# Altium project Capacitive_Sensor.PrjPcb
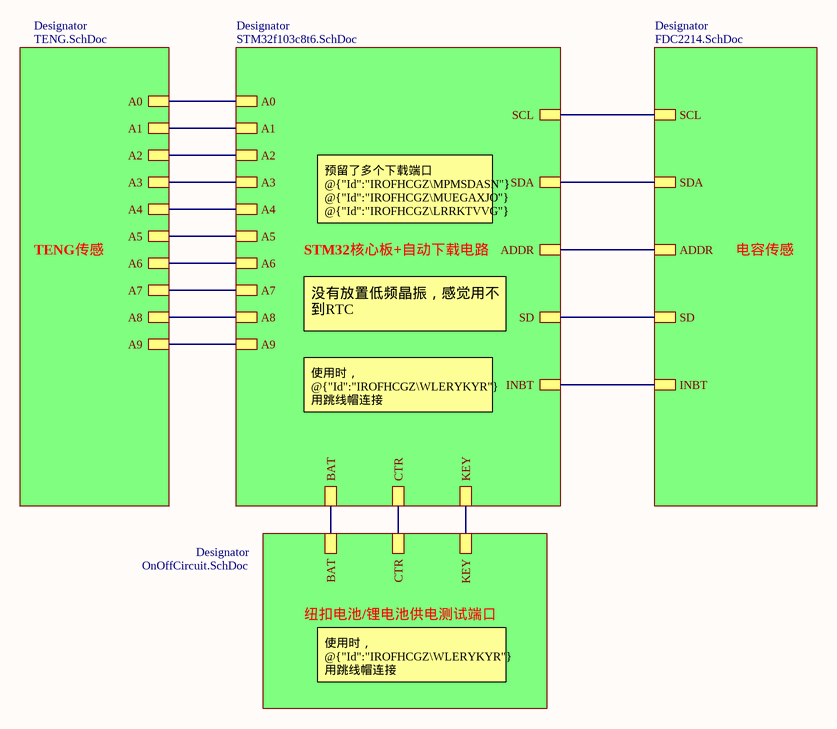
[diagram p0: Insight.SchDoc]
5 sheets, 156 parts. Net scope: hierarchical (ports join the sheet entries above them; power ports are global).
Board file: Cap_TENG.PcbDoc
Sheets:
  Insight.SchDoc
    Designator = STM32f103c8t6.SchDoc
    Designator = FDC2214.SchDoc
    Designator = TENG.SchDoc
    Designator = OnOffCircuit.SchDoc

## Sheet Insight.SchDoc
size A4; SheetNumber: 1; SheetTotal: 5

### Sub-sheets
Designator = STM32f103c8t6.SchDoc: A0, A1, A2, A3, A4, A5, A6, A7, A8, A9, SCL, SDA, ADDR, SD, INBT, BAT, CTR, KEY
Designator = FDC2214.SchDoc: SCL, SDA, SD, INBT, ADDR
Designator = TENG.SchDoc: A0, A1, A2, A3, A4, A5, A6, A7, A9, A8
Designator = OnOffCircuit.SchDoc: BAT, CTR, KEY

### Nets
A0: sheet Designator/A0, sheet Designator/A0
A1: sheet Designator/A1, sheet Designator/A1
A2: sheet Designator/A2, sheet Designator/A2
A3: sheet Designator/A3, sheet Designator/A3
A4: sheet Designator/A4, sheet Designator/A4
A5: sheet Designator/A5, sheet Designator/A5
A6: sheet Designator/A6, sheet Designator/A6
A7: sheet Designator/A7, sheet Designator/A7
A8: sheet Designator/A8, sheet Designator/A8
A9: sheet Designator/A9, sheet Designator/A9
B5: sheet Designator/SD, sheet Designator/SD
B6: sheet Designator/SCL, sheet Designator/SCL
B7: sheet Designator/SDA, sheet Designator/SDA
B8: sheet Designator/INBT, sheet Designator/INBT
B9: sheet Designator/ADDR, sheet Designator/ADDR
B12: sheet Designator/KEY, sheet Designator/KEY
B13: sheet Designator/CTR, sheet Designator/CTR
NetBAT1_1: sheet Designator/BAT, sheet Designator/BAT

### Notes on the sheet
- TENG传感
- STM32核心板+自动下载电路
- 预留了多个下载端口
  @{"Id":"IROFHCGZ\MPMSDASN"} @{"Id":"IROFHCGZ\MUEGAXJO"} @{"Id":"IROFHCGZ\LRRKTVVG"}
- 电容传感
- 没有放置低频晶振，感觉用不到RTC
- 使用时， @{"Id":"IROFHCGZ\WLERYKYR"}用跳线帽连接
  建议连接1，2引脚。
- 纽扣电池/锂电池供电测试端口
- 使用时， @{"Id":"IROFHCGZ\WLERYKYR"}用跳线帽连接
  建议连接2，3引脚。

## Sheet STM32f103c8t6.SchDoc
size A4; SheetNumber: 2; SheetTotal: 5
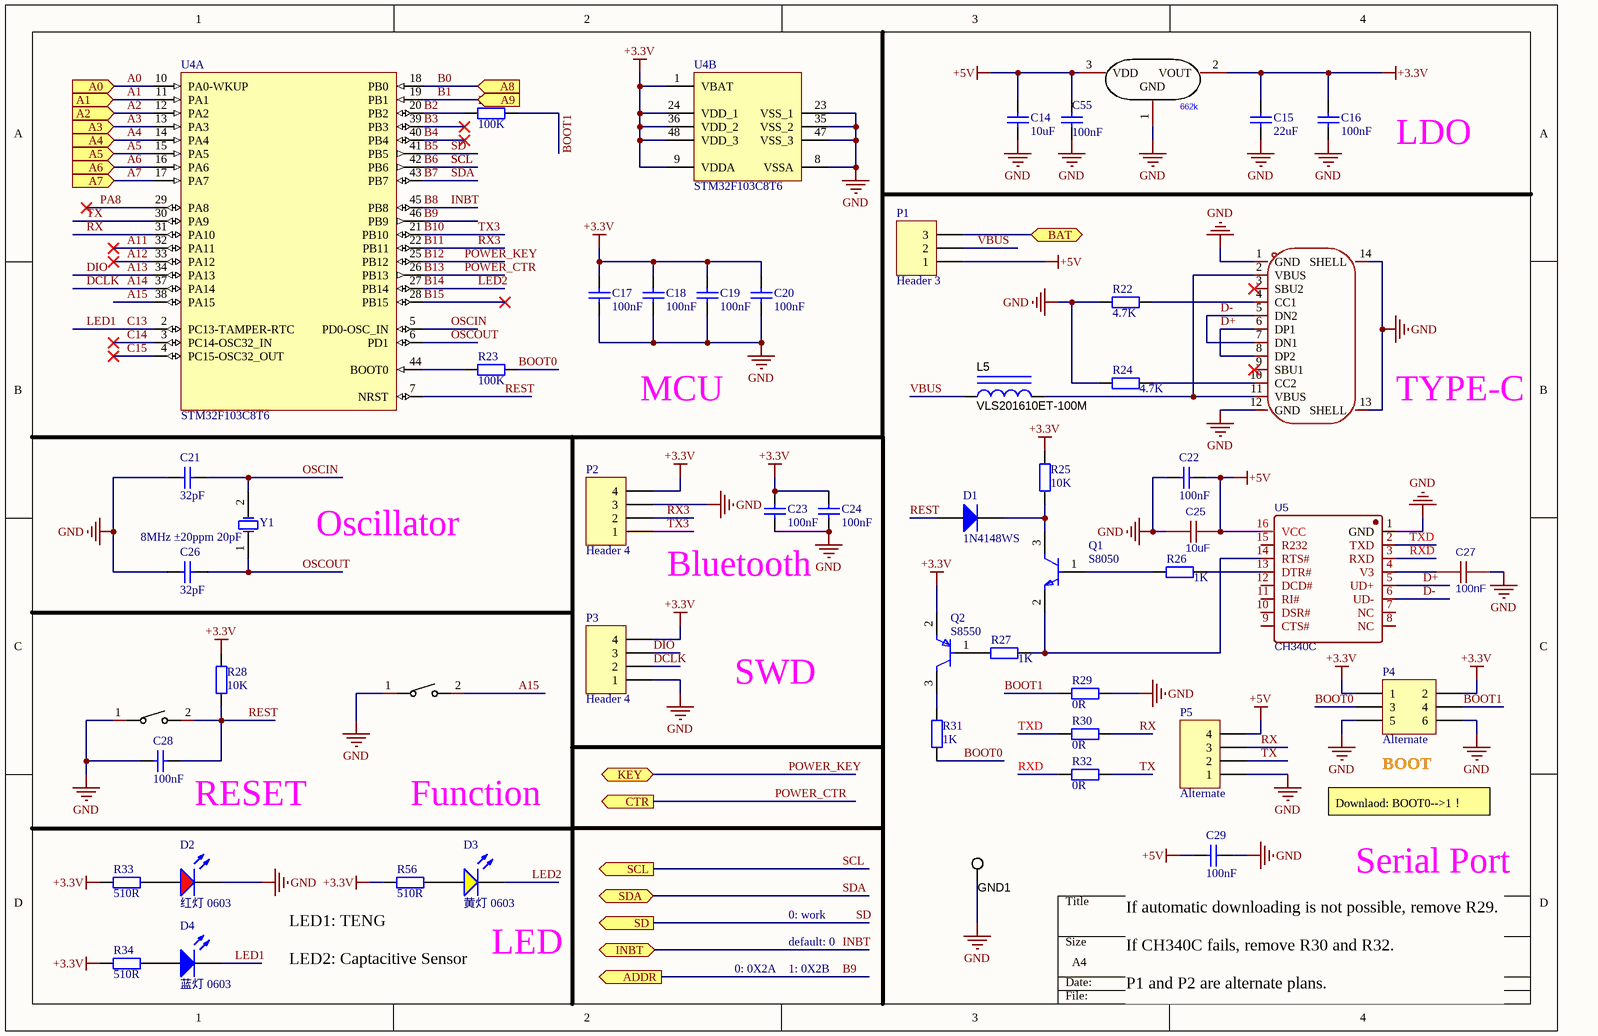
[diagram p1: STM32f103c8t6.SchDoc]

### Parts
C14  10uF  [0603]
C15  22uF  [0603]
C16  100nF  [0402_C]
C17  100nF  [0402_C]
C18  100nF  [0402_C]
C19  100nF  [0402_C]
C20  100nF  [0402_C]
C21  32pF  [0402_C]
C22  100nF  [0402_C]
C23  100nF  [0402_C]
C24  100nF  [0402_C]
C25  10uF  [0402_C]
C26  32pF  [0402_C]
C27  100nF  [0402_C]
C28  100nF  [0402_C]
C29  100nF  [0402_C]
C55  100nF  [0402_C]
D1  1N4148WS  [SOD-323]
D2  红灯 0603  [0603_LED_S1]
D3  黄灯 0603  [0603_LED_S1]
D4  蓝灯 0603  [0603_LED_S1]
GND1  5015  [Testpoint_Keystone_Miniature]  (value not drawn)
L5  VLS201610ET-100M  [VLS201610ET]
LDO1  662k  [SOT-23-3_L2.9-W1.3-P1.90-LS2.4-BR]
P1  Header 3  [SIP-3]
P2  Header 4  [XH254-4]
P3  Header 4  [SIP-4]
P4  Alternate  [HDR2X3 - SMT]
P5  Alternate  [SIP-4]
Q1  S8050  [FP-SS8050-G-IPC_B]
Q2  S8550  [FP-SOT-23-IPC_A]
R21  100K  [0402_R]
R22  4.7K  [0402_R]
R23  100K  [0402_R]
R24  4.7K  [0402_R]
R25  10K  [0402_R]
R26  1K  [0402_R]
R27  1K  [0402_R]
R28  10K  [0402_R]
R29  0R  [0805_R]
R30  0R  [0805_R]
R31  1K  [0402_R]
R32  0R  [0805_R]
R33  510R  [0402_R]
R34  510R  [0402_R]
R56  510R  [0402_R]
SW1  TS-1088-AR02016  [SW-SMD_L3.9-W3.0-P4.45]  (value not drawn)
SW2  TS-1088-AR02016  [SW-SMD_L3.9-W3.0-P4.45]  (value not drawn)
U4  STM32F103C8T6  [LQFP-48_7x7x05P]  (parts A,B of 2)
U5  CH340C  [SOP-16_150MIL]
USB1  TYPE-C 16PIN 2MD(073)  [USB-C-SMD_TYPE-C-6PIN-2MD-073]  (value not drawn)
Y1  8MHz ±20ppm 20pF  [SMD-5032_2P]

### Ports
A0 (in, see Insight[2A], TENG[4A]), A1 (in, see Insight[2B], TENG[4A]), A2 (in, see Insight[2B], TENG[4A]), A3 (in, see Insight[2B], TENG[4A]), A4 (in, see Insight[2B], TENG[4A]), A5 (in, see Insight[2B], TENG[4A]), A6 (in, see Insight[2B], TENG[4A]), A7 (in, see Insight[2B], TENG[4B]), A8 (in, see Insight[2B], TENG[4B]), A9 (in, see Insight[2B], TENG[4B]), ADDR (out, see Insight[3B], FDC2214[2A]), BAT (bidir, see Insight[2C], OnOffCircuit[1A], OnOffCircuit[3A]), CTR (out, see Insight[3C], OnOffCircuit[1B]), INBT (bidir, see Insight[3C], FDC2214[2A]), KEY (bidir, see Insight[3C], OnOffCircuit[3B]), SCL (out, see Insight[3A], FDC2214[2A]), SD (out, see Insight[3B], FDC2214[2A]), SDA (bidir, see Insight[3B], FDC2214[2A])

### Nets
+3.3V: C15.1 C16.1 C17.2 C18.2 C19.2 C20.2 C23.2 C24.2 LDO1.2(VOUT) P2.4 P3.4 P4.1 P4.2 Q2.2(E) R25.2 R28.2 R33.2 R34.2 R56.2 U4.1(VBAT) U4.9(VDDA) U4.24(VDD_1) U4.36(VDD_2) U4.48(VDD_3)
+5V: C14.1 C22.2 C25.1 C29.2 C55.2 LDO1.3(VDD) P1.1 P5.4 U5.16(VCC)
GND: C14.2 C15.2 C16.2 C17.1 C18.1 C19.1 C20.1 C21.1 C22.1 C23.1 C24.1 C25.2 C26.1 C27.2 C28.2 C29.1 C55.1 D2.K GND1.1 LDO1.1(GND) P2.3 P3.1 P4.5 P4.6 P5.1 R22.1 R24.1 R29.2 SW1.1 SW2.1 U4.8(VSSA) U4.23(VSS_1) U4.35(VSS_2) U4.47(VSS_3) U5.1(GND) USB1.1(GND) USB1.12(GND) USB1.13(SHELL) USB1.14(SHELL)
A0: U4.10(PA0-WKUP) ; port A0
A1: U4.11(PA1) ; port A1
A2: U4.12(PA2) ; port A2
A3: U4.13(PA3) ; port A3
A4: U4.14(PA4) ; port A4
A5: U4.15(PA5) ; port A5
A6: U4.16(PA6) ; port A6
A7: U4.17(PA7) ; port A7
A11: U4.32(PA11)
A12: U4.33(PA12)
A13: P3.3 U4.34(PA13)  [also labelled DIO]
A14: P3.2 U4.37(PA14)  [also labelled DCLK]
A15: SW1.2 U4.38(PA15)
B0: U4.18(PB0) ; port A8  [project net A8]
B1: U4.19(PB1) ; port A9  [project net A9]
B2: R21.1 U4.20(PB2)
B3: U4.39(PB3)
B4: U4.40(PB4)
B5: U4.41(PB5) ; port SD  [also labelled SD]
B6: U4.42(PB6) ; port SCL  [also labelled SCL]
B7: U4.43(PB7) ; port SDA  [also labelled SDA]
B8: U4.45(PB8) ; port INBT  [also labelled INBT]
B9: U4.46(PB9) ; port ADDR
B10: P2.1 U4.21(PB10)  [also labelled TX3]
B11: P2.2 U4.22(PB11)  [also labelled RX3]
B12: U4.25(PB12) ; port KEY  [also labelled POWER_KEY]
B13: U4.26(PB13) ; port CTR  [also labelled POWER_CTR]
B14: D3.K U4.27(PB14)  [also labelled LED2]
B15: U4.28(PB15)
BOOT0: P4.3 R23.2 R31.1
BOOT1: P4.4 R21.2 R29.1
C13: D4.K U4.2(PC13-TAMPER-RTC)  [also labelled LED1]
C14: U4.3(PC14-OSC32_IN)
C15: U4.4(PC15-OSC32_OUT)
D+: U5.5(UD+) USB1.6(DP1) USB1.8(DP2)
D-: U5.6(UD-) USB1.5(DN2) USB1.7(DN1)
OSCIN: C21.2 U4.5(PD0-OSC_IN) Y1.2(OSC2)
OSCOUT: C26.2 U4.6(PD1) Y1.1(OSC1)
PA8: U4.29(PA8)
REST: C28.1 D1.1(A) R28.1 SW2.2 U4.7(NRST)
RX: P5.3 R30.2 U4.31(PA10)
RXD: R32.1 U5.3(RXD)
TX: P5.2 R32.2 U4.30(PA9)
TXD: R30.1 U5.2(TXD)
VBUS: L5.1 P1.2
NetBAT1_1: P1.3 ; port BAT
NetC27_1: C27.1 U5.4(V3)
NetD1_2: D1.2(K) Q1.3(C) R25.1
NetD2_A: D2.A R33.1
NetD3_A: D3.A R56.1
NetD4_A: D4.A R34.1
NetL5_2: L5.2 USB1.2(VBUS) USB1.11(VBUS)
NetQ1_1: Q1.1(B) R26.1
NetQ1_2: Q1.2(E) R27.2 U5.14(RTS#)
NetQ2_1: Q2.1(B) R27.1
NetQ2_3: Q2.3(C) R31.2
NetR22_2: R22.2 USB1.4(CC1)
NetR23_1: R23.1 U4.44(BOOT0)
NetR24_2: R24.2 USB1.10(CC2)
NetR26_2: R26.2 U5.13(DTR#)

Not connected (* = marked no-connect by the designer): U5 7(NC) 8(NC) 9(CTS#) 10(DSR#) 11(RI#) 12(DCD#) 15(R232); USB1 3(SBU2)* 9(SBU1)*

### Notes on the sheet
- LDO
- MCU
- (near USB1) TYPE-C
- Oscillator
- Bluetooth
- SWD
- (near P4) BOOT
- (near C28) RESET
- Function
- Downlaod: BOOT0-->1！
- 0: work
- Serial Port
- LED1: TENG
  LED2: Captacitive Sensor
- (near D3) LED
- 0: 0X2A
- default: 0
- 1: 0X2B
- (near C29) If automatic downloading is not possible, remove R29.
  If CH340C fails, remove R30 and R32.
  P1 and P2 are alternate plans.

### Library data of the parts
C14-C24 C26 C28 C29 C55 = Cap_0402: 0402贴片电容; Package: 0402; 常见贴片电容尺寸图: https://wenku.baidu.com/view/21d5206100f69e3143323968011ca300a6c3f6b2.html
C25 C27 = C: BOM_Manufacturer: SEIKO; BOM_Manufacturer Part: XH414HG-IV01E; nameAlias: Capacitance; BOM_Supplier: LCSC; BOM_Supplier Part: C38065; spicePre: C; spiceSymbolName: XH414HG-IV01E
D1 = 1N4148WS_SOD-323: 二极管; ComponentLink1Description: 供应商链接; ComponentLink1URL: http://www.szlcsc.com/product/details_2485.html; Package: SOD-323; Supplier: LC; SuppliersPartNumber: C2128
D2 = 0603 红灯: 发光二极管; ComponentLink1Description: 供应商链接; ComponentLink1URL: http://www.szlcsc.com/product/details_2659.html; Package: 0603; Supplier: LC; SuppliersPartNumber: C2286
D3 = 0603 黄灯: 发光二极管; ComponentLink1Description: 供应商链接; ComponentLink1URL: http://www.szlcsc.com/product/details_73147.html; Package: 0603; Supplier: LC; SuppliersPartNumber: C72038
D4 = 0603 蓝灯: 发光二极管; ComponentLink1Description: 供应商链接; ComponentLink1URL: http://www.szlcsc.com/product/details_73150.html; Package: 0603; Supplier: LC; SuppliersPartNumber: C72041
GND1 = 5015: Test Point, Miniature, SMT; Manufacturer: Keystone; CompType: Test Point Loop; U/M: EA; SymbolVersion: 2008-07-10; PartNumber: 5015; Value: SMT; PackageReference: Testpoint_Keystone_Miniature; RoHS: Y; MountType: SMT; ComponentLink1Description: Datasheet Link; ComponentLink1URL: http://www.keyelco.com/userAssets/store/files/5015.PDF; Publisher: Texas Instruments; LatestRevisionDate: 2014-09-23; Supplier 1: Digi-Key; Supplier Part Number 1: 5015KCT-ND
L5 = VLS201610ET-100M: Inductor, Shielded, Ferrite, 10 μH, 0.4 A, 1.38 ohm, SMD; Manufacturer: TDK; Value: 10uH; Ind_H: 10.0E-6; ValueDisplayed: 10μH; Imax_A: 0.4; Irms: 0.42A @ 40C rise; Isat: 0.4A @ 30% inductance drop; DCR_ohm: 1.38; Value2: 0.4A; SymbolVersion: 2008-07-23; CompType: Inductor; PartNumber: VLS201610ET-100M; Value1: 1.38 ohm; Technology: Shielded; MountType: SMT; Material: Ferrite; PackageReference: 2.0x0.95x1.6mm; Published: 2008-06-26; Publisher: Texas Instruments; LatestRevisionDate: 2015-01-12; ComponentLink1Description: Datasheet link; ComponentLink1URL: http://product.tdk.com/inductor/ind/en/documents/inductor_commercial_power_vls_en.pdf; RoHS: Y; Supplier 1: Digi-Key; Supplier Part Number 1: 445-6608-1-ND; Supplier 2: Mouser; Supplier Part Number 2: 810-VLS201610ET-100M
LDO1 = SC662K-3.3V: Manufacturer: FM(富满); Add into BOM: yes; Output Type: 固定; Maximum Input Voltage: 6V; Output Voltage: 3.3V; MAX Output Current: 250mA; Power Supply Rejection Ratio (PSRR): 50dB@(1kHz); Dropout Voltage: 38mV@(10mA); Output Polarity: 正极; Number of Outputs: 1; Name: SC662K-3.3V; Symbol: SC662K-3.3V; Device: SC662K-3.3V; LCSC Part Name: 输入6V 输出3.3V 250mA 停产 停产; Supplier Part: C83932; Manufacturer Part: SC662K-3.3V; Supplier Footprint: SOT-23; JLCPCB Part Class: Extended Part; Datasheet: https://atta.szlcsc.com/upload/public/pdf/source/20161024/1477288576049.pdf; Supplier: LCSC; Convert to PCB: yes
P1 = Header 3: Header, 3-Pin; LatestRevisionDate: 17-Jul-2002; LatestRevisionNote: Re-released for DXP Platform.; Publisher: Altium Limited
P2 P3 P5 = Header 4: Header, 4-Pin; LatestRevisionDate: 17-Jul-2002; LatestRevisionNote: Re-released for DXP Platform.; Publisher: Altium Limited
P4 = Header 3X2: Header, 3-Pin, Dual row; LatestRevisionDate: 17-Jul-2002; LatestRevisionNote: Re-released for DXP Platform.; Publisher: Altium Limited
Q1 = S8050: NPN TRANSISTOR 1.5A 40V SOT-23 R; Transition Frequency: 100MHz; Max Breakdown Voltage: 25V; Collector Emitter Voltage (VCEO): 400mV; Max Power Dissipation: 300mW; Max Collector Current: 1.5A; Case/Package: TO-236-3; Packaging: Tape and Reel; RoHS Compliant: Yes; Mount: Surface Mount; Collector Emitter Breakdown Voltage: 25V
Q2 = S8550: TRANS PNP 25V 1.5A SOT23; Emitter Base Voltage (VEBO): 1.6V; Collector Base Voltage (VCBO): 40V; Collector Emitter Saturation Voltage: 500mV; Max Power Dissipation: 625mW; Transition Frequency: 100MHz; Element Configuration: Single; hFE Min: 40; Polarity: PNP; Lead Free: Lead Free; Max Breakdown Voltage: 25V; Package Quantity: 1; Min Operating Temperature: -55°C; Case/Package: SOT-23; Max Collector Current: 1.5A; Mount: Surface Mount; Packaging: Tape and Reel; Collector Emitter Voltage (VCEO): 500mV; Max Operating Temperature: 150°C; Gain Bandwidth Product: 100MHz; Collector Emitter Breakdown Voltage: 25V
R21-R28 R33 R34 R56 = Res_0402: 贴片电阻; ComponentLink1Description: 供应商链接; ComponentLink1URL: http://www.szlcsc.com/product/details_17853.html; Package: 0402; Supplier: LC; SuppliersPartNumber: C17168
R29-R32 = Res_0805: 0805贴片电阻; ComponentLink1Description: 供应商链接; ComponentLink1URL: http://www.szlcsc.com/product/details_26856.html; Package: 0805; Supplier: LC; SuppliersPartNumber: C26113
SW1 SW2 = Key: Manufacturer: XUNPU(讯普); Add into BOM: yes; Circuit: 单刀单掷; Actuator Style: 圆形按钮; Operating Force: 160gf; Switch Length: 4mm; Switch Width: 3mm; Switch Height: 2mm; Strike Gundam: 不带; Contact Current: 50mA; Voltage Rating (DC): 12V; Insulation Resistance: 100MΩ; Actuator/Cap Color: 黑色; Pin Style: SMD接片; Mechanical Life: 10万次; Symbol: TS-1088-AR02016; Device: TS-1088-AR02016; Supplier: LCSC; Supplier Part: C720477; Manufacturer Part: TS-1088-AR02016; JLCPCB Part Class: Extended Part; LCSC Part Name: 4*3*2mm 立贴 轻触开关; Supplier Footprint: SMD; Datasheet: https://atta.szlcsc.com/upload/public/pdf/source/20200810/C720475_60D09DD6C54279ADDB2DC25100F1CC11.pdf; Convert to PCB: yes; Mounting Style: 立贴; Operating Temperature: -30℃~+80℃
U4 = STM32F103C8T6: ARM; ComponentLink1Description: 供应商链接; ComponentLink1URL: http://www.szlcsc.com/product/details_9243.html; Package: LQFP-48_7x7x05P; Supplier: LC; SuppliersPartNumber: C8734
U5 = CH340C: BOM_Manufacturer: WCH; BOM_Supplier: LCSC; BOM_Manufacturer Part: CH340C; BOM_Supplier Part: C84681; spicePre: U
USB1 = TYPE-C 16PIN 2MD(073): Manufacturer: SHOU HAN(首韩); Add into BOM: yes; Gender: 母; Number of Ports: 1; Number of Contacts: 16P; Current Rating - Power (Max): 5A; Symbol: TYPE-C 16PIN 2MD(073); Device: TYPE-C 16PIN 2MD(073); LCSC Part Name: Type-C 母 卧贴; Supplier Part: C2765186; Manufacturer Part: TYPE-C 16PIN 2MD(073); Supplier Footprint: SMD; JLCPCB Part Class: Extended Part; Datasheet: https://atta.szlcsc.com/upload/public/pdf/source/20211123/39B17C16241EAC15C5E277BDA434118E.pdf; Supplier: LCSC; Convert to PCB: yes; Connector Type: Type-C; Standard: -; Mounting Style: 卧贴; Operating Temperature Range: -25℃~+85℃
Y1 = SMD-5032_2P 8MHz 20ppm 20pF: 贴片晶振; ComponentLink1Description: 供应商链接; ComponentLink1URL: http://www.szlcsc.com/product/details_19261.html; Package: SMD-5032_2P; Supplier: LC; SuppliersPartNumber: C18560

## Sheet FDC2214.SchDoc
size A4; SheetNumber: 4; SheetTotal: 5
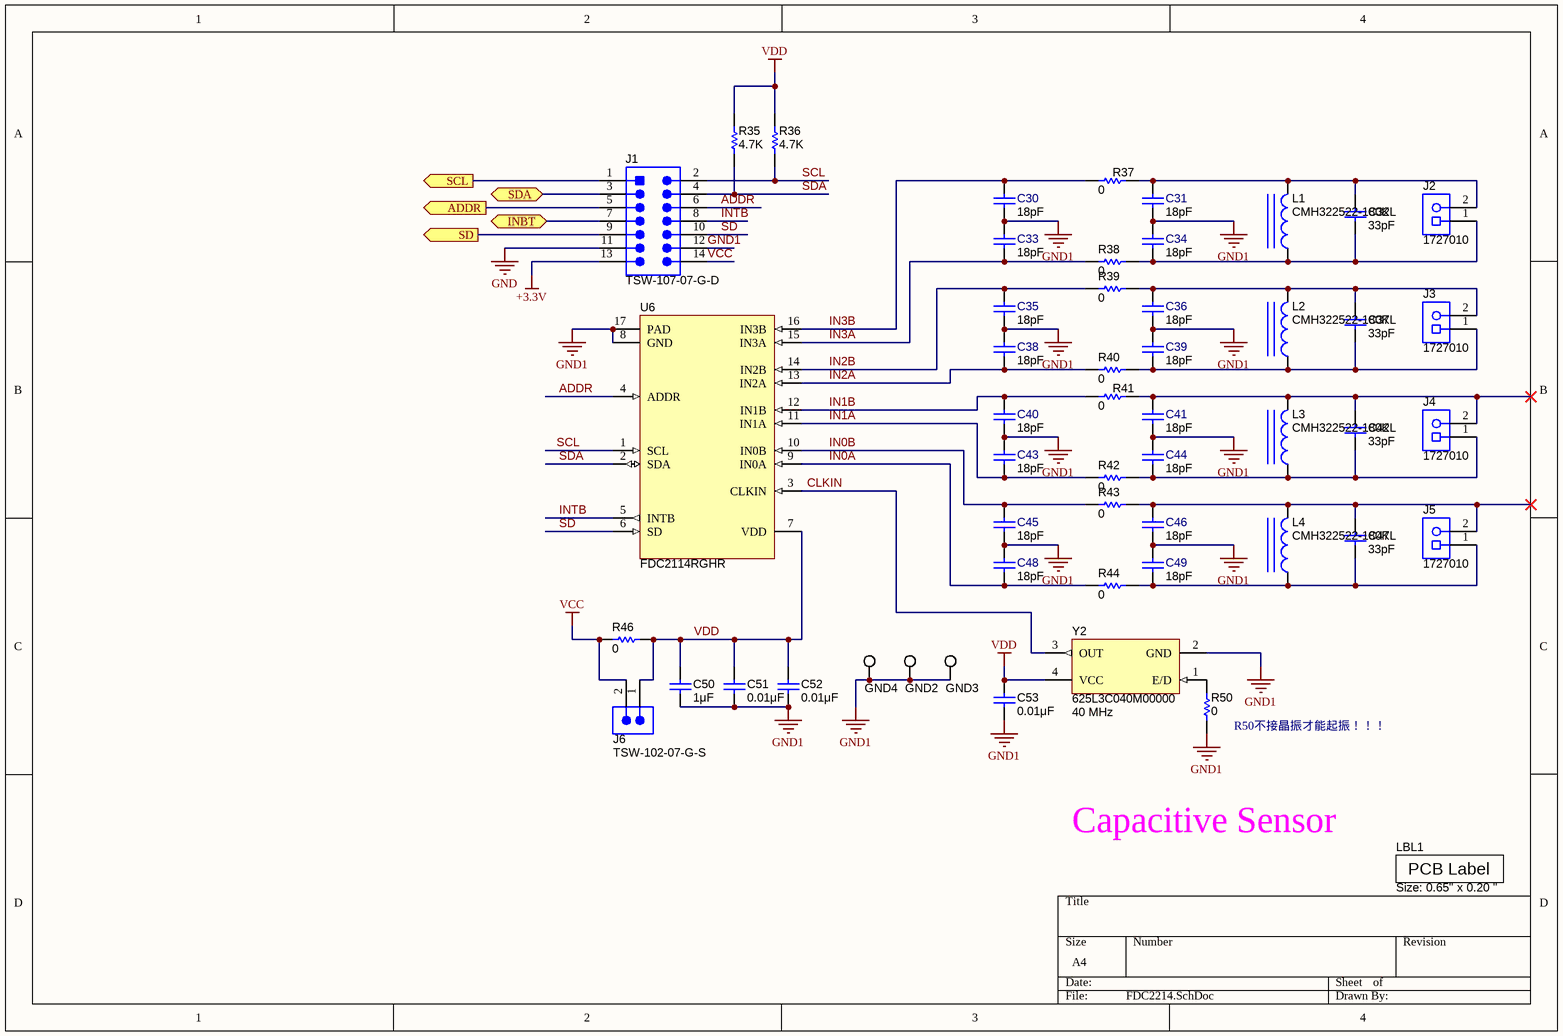
[diagram p2: FDC2214.SchDoc]

### Parts
C30  ValueDisplayed: 18pF  [0603]  (hidden comment: GRM1885C2A180JA01D)
C31  ValueDisplayed: 18pF  [0603]  (hidden comment: GRM1885C2A180JA01D)
C32  ValueDisplayed: 33pF  [0603_950]  (hidden comment: CL10C330FB8NNNC)
C33  ValueDisplayed: 18pF  [0603]  (hidden comment: GRM1885C2A180JA01D)
C34  ValueDisplayed: 18pF  [0603]  (hidden comment: GRM1885C2A180JA01D)
C35  ValueDisplayed: 18pF  [0603]  (hidden comment: GRM1885C2A180JA01D)
C36  ValueDisplayed: 18pF  [0603]  (hidden comment: GRM1885C2A180JA01D)
C37  ValueDisplayed: 33pF  [0603_950]  (hidden comment: CL10C330FB8NNNC)
C38  ValueDisplayed: 18pF  [0603]  (hidden comment: GRM1885C2A180JA01D)
C39  ValueDisplayed: 18pF  [0603]  (hidden comment: GRM1885C2A180JA01D)
C40  ValueDisplayed: 18pF  [0603]  (hidden comment: GRM1885C2A180JA01D)
C41  ValueDisplayed: 18pF  [0603]  (hidden comment: GRM1885C2A180JA01D)
C42  ValueDisplayed: 33pF  [0603_950]  (hidden comment: CL10C330FB8NNNC)
C43  ValueDisplayed: 18pF  [0603]  (hidden comment: GRM1885C2A180JA01D)
C44  ValueDisplayed: 18pF  [0603]  (hidden comment: GRM1885C2A180JA01D)
C45  ValueDisplayed: 18pF  [0603]  (hidden comment: GRM1885C2A180JA01D)
C46  ValueDisplayed: 18pF  [0603]  (hidden comment: GRM1885C2A180JA01D)
C47  ValueDisplayed: 33pF  [0603_950]  (hidden comment: CL10C330FB8NNNC)
C48  ValueDisplayed: 18pF  [0603]  (hidden comment: GRM1885C2A180JA01D)
C49  ValueDisplayed: 18pF  [0603]  (hidden comment: GRM1885C2A180JA01D)
C50  ValueDisplayed: 1μF  [0402]  (hidden comment: GRM155R61A105KE15D)
C51  ValueDisplayed: 0.01μF  [0402]  (hidden comment: C1005X7R1C103K)
C52  ValueDisplayed: 0.01μF  [0402]  (hidden comment: C1005X7R1C103K)
C53  ValueDisplayed: 0.01μF  [0402]  (hidden comment: C1608C0G1E103J)
GND2  5015  [Testpoint_Keystone_Miniature]  (value not drawn)
GND3  5015  [Testpoint_Keystone_Miniature]  (value not drawn)
GND4  5015  [Testpoint_Keystone_Miniature]  (value not drawn)
J1  TSW-107-07-G-D  [TSW-107-07-G-D]
J2  1727010  [PhoenixConact_1727010]
J3  1727010  [PhoenixConact_1727010]
J4  1727010  [PhoenixConact_1727010]
J5  1727010  [PhoenixConact_1727010]
J6  TSW-102-07-G-S  [TSW-102-07-G-S]
L1  CMH322522-180KL  [CMH322522]
L2  CMH322522-180KL  [CMH322522]
L3  CMH322522-180KL  [CMH322522]
L4  CMH322522-180KL  [CMH322522]
LBL1  Size: 0.65" x 0.20 "  [Label_650x200]
R35  value 4.7K  [0402_R]  (hidden comment: CRCW06030000Z0EA)
R36  value 4.7K  [0402_R]  (hidden comment: CRCW06030000Z0EA)
R37  value 0  [0805_HV]  (hidden comment: CRCW08050000Z0EA)
R38  value 0  [0805_HV]  (hidden comment: CRCW08050000Z0EA)
R39  value 0  [0805_HV]  (hidden comment: CRCW08050000Z0EA)
R40  value 0  [0805_HV]  (hidden comment: CRCW08050000Z0EA)
R41  value 0  [0805_HV]  (hidden comment: CRCW08050000Z0EA)
R42  value 0  [0805_HV]  (hidden comment: CRCW08050000Z0EA)
R43  value 0  [0805_HV]  (hidden comment: CRCW08050000Z0EA)
R44  value 0  [0805_HV]  (hidden comment: CRCW08050000Z0EA)
R46  value 0  [0805_R]  (hidden comment: CRCW06030000Z0EA)
R50  value 0  [0805_HV]  (hidden comment: CRCW06030000Z0EA)
U6  FDC2114RGHR  [RGH0016A]
Y2  625L3C040M00000  Frequency: 40 MHz  [OSC_CTS_625]

### Ports
ADDR (out, see Insight[3B], STM32f103c8t6[2D]), INBT (bidir, see Insight[3C], STM32f103c8t6[2D]), SCL (out, see Insight[3A], STM32f103c8t6[2D]), SD (out, see Insight[3B], STM32f103c8t6[2D]), SDA (bidir, see Insight[3B], STM32f103c8t6[2D])

### Nets
+3.3V: J1.13
GND: J1.11
GND1: C30.1 C31.1 C33.2 C34.2 C35.1 C36.1 C38.2 C39.2 C40.1 C41.1 C43.2 C44.2 C45.1 C46.1 C48.2 C49.2 C50.2 C51.2 C52.2 C53.2 GND2.1 GND3.1 GND4.1 J1.12 R50.1 U6.8(GND) U6.17(PAD) Y2.2(GND)
VCC: J1.14 J6.2 R46.1
VDD: C50.1 C51.1 C52.1 C53.1 J6.1 R35.2 R36.2 R46.2 U6.7(VDD) Y2.4(VCC)
ADDR: J1.6 U6.4(ADDR)
B5: J1.9 ; port SD
B6: J1.1 ; port SCL
B7: J1.3 ; port SDA
B8: J1.7 ; port INBT
B9: J1.5 ; port ADDR
CLKIN: U6.3(CLKIN) Y2.3(OUT)
IN0A: C48.1 R44.1 U6.9(IN0A)
IN0B: C45.2 R43.1 U6.10(IN0B)
IN1A: C43.1 R42.1 U6.11(IN1A)
IN1B: C40.2 R41.1 U6.12(IN1B)
IN2A: C38.1 R40.1 U6.13(IN2A)
IN2B: C35.2 R39.1 U6.14(IN2B)
IN3A: C33.1 R38.1 U6.15(IN3A)
IN3B: C30.2 R37.1 U6.16(IN3B)
INTB: J1.8 U6.5(INTB)
SCL: J1.2 R36.1 U6.1(SCL)
SD: J1.10 U6.6(SD)
SDA: J1.4 R35.1 U6.2(SDA)
NetC31_2: C31.2 C32.1 J2.2 L1.2 R37.2
NetC32_2: C32.2 C34.1 J2.1 L1.1 R38.2
NetC36_2: C36.2 C37.1 J3.2 L2.2 R39.2
NetC37_2: C37.2 C39.1 J3.1 L2.1 R40.2
NetC41_2: C41.2 C42.1 J4.2 L3.2 R41.2
NetC42_2: C42.2 C44.1 J4.1 L3.1 R42.2
NetC46_2: C46.2 C47.1 J5.2 L4.2 R43.2
NetC47_2: C47.2 C49.1 J5.1 L4.1 R44.2
NetR50_2: R50.2 Y2.1(E/D)

### Notes on the sheet
- (near R50) R50不接晶振才能起振！！！
- Capacitive Sensor
- (in symbol THT-14-423-10) PCB Label

### Library data of the parts
C30 C31 C33-C36 C38-C41 C43-C46 C48 C49 = GRM1885C2A180JA01D: CAP, CERM, 18pF, 100V, +/-5%, C0G/NP0, 0603; Manufacturer: MuRata; Polarized: N; CompType: Capacitor; U/M: EA; Cap_F: 0.000000000018; Tolerance_%: 5; Value1: Unknown; VDC_V: 100; TaMin_C: -55; TaMax_C: 125; SymbolVersion: 2008-07-09; Value: 18pF; PartNumber: GRM1885C2A180JA01D; PackageReference: 0603; RoHS: Y; Value2: 100V; MountType: SMT; Technology: Ceramic; TempCo: C0G/NP0; Cap_Case: 0603; Published: 2008-06-19; Publisher: Texas Instruments; LatestRevisionDate: 2014-04-03; ComponentLink1Description: Datasheet link; ComponentLink1URL: http://search.murata.co.jp/Ceramy/PnsearchViewAction.do?HnOFG=ON&HnNFG=ON&SEL_CNT=50&sLang=en&sKey=GRM1885C2A180JA01D&x=9&y=9&search=startwith; Supplier 1: Digi-Key; Supplier Part Number 1: 490-1333-1-ND; Supplier 2: Mouser; Supplier Part Number 2: 81-GRM1885C2A180JA01
C32 C37 C42 C47 = CL10C330FB8NNNC: CAP, CERM, 33 pF, 50 V, +/- 1%, C0G/NP0, 0603_950; Manufacturer: Samsung; Polarized: N; CompType: Capacitor; Value: 33pF; U/M: EA; Cap_F: 0.000000000033; Tolerance_%: 1; Value1: Unknown; VDC_V: 50; Value2: 50V; TaMin_C: -55; TaMax_C: 125; Cap_Case: 0603; SymbolVersion: 2008-07-09; PartNumber: CL10C330FB8NNNC; PackageReference: 0603_950; RoHS: Y; MountType: SMT; Technology: Ceramic; TempCo: C0G/NP0; Published: 2008-06-19; Publisher: Texas Instruments; LatestRevisionDate: 2015-03-17; ComponentLink1Description: Datasheet link; ComponentLink1URL: http://www.samsungsem.com/kr/front/downloadcms.do?path=/kr/support/product-search/mlcc/__icsFiles/afieldfile/2014/11/05&fileName=S_CL10C330FB8NNNC.pdf; Supplier 1: Digi-Key; Supplier Part Number 1: 1276-2262-1-ND
C50 = GRM155R61A105KE15D: CAP, CERM, 1uF, 10V, +/-10%, X5R, 0402; Manufacturer: MuRata; Polarized: N; CompType: Capacitor; U/M: EA; Cap_F: 0.000001; Tolerance_%: 10; Value1: Unknown; TaMin_C: -55; TaMax_C: 85; SymbolVersion: 2008-07-09; Value: 1uF; PartNumber: GRM155R61A105KE15D; PackageReference: 0402; RoHS: Y; VDC_V: 10; Value2: 10V; MountType: SMT; Technology: Ceramic; TempCo: X5R; Cap_Case: 0402; Published: 2008-06-19; Publisher: Texas Instruments; LatestRevisionDate: 2013-02-06; LatestRevisionNote: Changed publisher; ComponentLink1Description: Datasheet link; ComponentLink1URL: http://search.murata.co.jp/Ceramy/PnsearchViewAction.do?HnOFG=ON&HnNFG=ON&SEL_CNT=50&sLang=en&sKey=GRM155R61A105KE15D&x=9&y=9&search=startwith; Supplier 1: Digi-Key; Supplier Part Number 1: 490-3890-1-ND; Supplier 2: Mouser; Supplier Part Number 2: 81-GRM155R61A105KE15; Supplier 3: Farnell; Supplier Part Number 3: 1735523
C51 = C1005X7R1C103K: CAP CER 0.1UF 16V 5% X7R 0402; Manufacturer: TDK; Polarized: N; CompType: Capacitor; Value: 0.01uF; U/M: EA; Cap_F: 0.00000001; Tolerance_%: 10; ESR_ohm: 0.0623; Value1: 0.0623 ohm; VDC_V: 16; TaMin_C: -55; TaMax_C: 125; SymbolVersion: 2008-07-09; PartNumber: C1005X7R1C103K; PackageReference: 0402; RoHS: Y; Value2: 16V; MountType: SMT; Technology: Ceramic; TempCo: X7R; Cap_Case: 0402; Published: 2008-06-19; Publisher: Texas Instruments; LatestRevisionDate: 2015-02-18; ComponentLink1Description: Datasheet link; ComponentLink1URL: http://www.tdk.co.jp/tefe02/e412_c.pdf; Supplier 1: Digi-Key; Supplier Part Number 1: 445-1262-1-ND; Supplier 2: Farnell; Supplier Part Number 2: 1844125
C52 = C1005X7R1C103K: CAP, CERM, 0.01 μF, 16 V, +/- 10%, X7R, 0402; Manufacturer: TDK; Polarized: N; CompType: Capacitor; Value: 0.01uF; U/M: EA; Cap_F: 0.00000001; Tolerance_%: 10; ESR_ohm: 0.0623; Value1: 0.0623 ohm; VDC_V: 16; Value2: 16V; TaMin_C: -55; TaMax_C: 125; SymbolVersion: 2008-07-09; PartNumber: C1005X7R1C103K; PackageReference: 0402; RoHS: Y; MountType: SMT; Technology: Ceramic; TempCo: X7R; Cap_Case: 0402; Published: 2008-06-19; Publisher: Texas Instruments; LatestRevisionDate: 2015-02-18; ComponentLink1Description: Datasheet link; ComponentLink1URL: http://www.tdk.co.jp/tefe02/e412_c.pdf; Supplier 1: Digi-Key; Supplier Part Number 1: 445-1262-1-ND; Supplier 2: Farnell; Supplier Part Number 2: 1844125
C53 = C1608C0G1E103J: CAP, CERM, 0.01uF, 25V, +/-5%, C0G/NP0, 0603; Manufacturer: TDK; Polarized: N; CompType: Capacitor; U/M: EA; Cap_F: 0.00000001; Tolerance_%: 5; VDC_V: 25; TaMin_C: -55; TaMax_C: 125; Cap_Case: 0603; SymbolVersion: 2008-07-09; Value: 0.01uF; PartNumber: C1608C0G1E103J; PackageReference: 0603; RoHS: Y; Value1: ?; Value2: 25V; MountType: SMT; Technology: Ceramic; TempCo: C0G/NP0; Published: 2008-06-19; Publisher: Texas Instruments; LatestRevisionDate: 2012-08-23; LatestRevisionNote: Changed publisher; ComponentLink1Description: Datasheet link; ComponentLink1URL: http://www.tdk.co.jp/tefe02/e412_c.pdf; Alternate PartNumber: -; Alternate Manufacturer: -; Supplier 1: Digi-Key; Supplier Part Number 1: 445-2664-1-ND; Supplier 2: Arrow; Supplier Part Number 2: C1608C0G1E103J
GND2-GND4 = 5015: as GND1 on sheet STM32f103c8t6; SymbolVersion: 2008-07-10; PartNumber: 5015; Value: SMT; PackageReference: Testpoint_Keystone_Miniature; RoHS: Y; MountType: SMT; ComponentLink1Description: Datasheet Link; ComponentLink1URL: http://www.keyelco.com/userAssets/store/files/5015.PDF; Publisher: Texas Instruments; LatestRevisionDate: 2014-09-23; Supplier 1: Digi-Key; Supplier Part Number 1: 5015KCT-ND
J1 = TSW-107-07-G-D: Header, 100mil, 7x2, Gold, TH; Manufacturer: Samtec; SymbolCreator: a0412235; U/M: EA; SymbolVersion: 2013-12-22; PartNumber: TSW-107-07-G-D; PackageReference: 7x2 Header; ClassName: Header; CompType: Header; RoHS: Y; MountType: TH; ComponentLink1Description: Datasheet Link; ComponentLink1URL: http://samtec.com/ftppub/pdf/TSW_TH.PDF; Publisher: Texas Instruments; LatestRevisionDate: 2015-02-04; Supplier 1: Digi-Key; Supplier Part Number 1: SAM1028-07-ND
J2-J5 = 1727010: Conn Term Block, 2POS, 3.81mm, TH; Manufacturer: Phoenix Contact; SymbolCreator: a0412235; CompType: Terminal Block; U/M: EA; Value: 2x1; SymbolVersion: 2013-09-04; PartNumber: 1727010; PackageReference: 2POS Terminal Block; RoHS: Y; MountType: TH; ComponentLink1Description: Datasheet Link; ComponentLink1URL: http://eshop.phoenixcontact.com/phoenix/pdf.do?UID=1727010&general=usen; Publisher: Texas Instruments; LatestRevisionDate: 2015-02-16; Supplier 1: Digi-Key; Supplier Part Number 1: 277-1947-ND
J6 = TSW-102-07-G-S: Header, TH, 100mil, 2x1, Gold plated, 230 mil above insulator; Manufacturer: Samtec, Inc.; SymbolCreator: a0412235; U/M: EA; SymbolVersion: 2013-03-14; PartNumber: TSW-102-07-G-S; ClassName: Header; CompType: Header; RoHS: Y; PackageReference: TSW-102-07-G-S; MountType: TH; ComponentLink1Description: Datasheet Link; ComponentLink1URL: http://samtec.com/ftppub/pdf/TSW_TH.PDF; Publisher: Texas Instruments; LatestRevisionDate: 2013-04-23; Supplier 1: Digi-Key; Supplier Part Number 1: SAM1029-02-ND
L1-L4 = CMH322522-180KL: Inductor, Shielded, Ferrite, 18 μH, 0.12 A, 3.3 ohm, SMD; Manufacturer: Bourns; Value: 18uH; Ind_H: 18.0E-6; ValueDisplayed: 18μH; Imax_A: 0.12; Irms: 0.12A @ 20C rise; DCR_ohm: 3.3; Value1: 3.3 ohm; Value2: 0.12A; SymbolVersion: 2008-07-23; CompType: Inductor; PartNumber: CMH322522-180KL; Technology: Shielded; MountType: SMT; Material: Ferrite; PackageReference: 3.2x2.2x2.5mm; Published: 2008-06-26; Publisher: Texas Instruments; LatestRevisionDate: 2015-04-21; ComponentLink1Description: Datasheet link; ComponentLink1URL: http://www.bourns.com/data/global/pdfs/CMH322522.pdf; RoHS: Y; Supplier 1: Digi-Key; Supplier Part Number 1: CMH322522-180KLCT-ND; Supplier 2: Mouser; Supplier Part Number 2: 652-CMH322522-180KL
LBL1 = THT-14-423-10: Thermal Transfer Printable Labels, 0.650" W x 0.200" H - 10,000 per roll; Manufacturer: Brady; SymbolCreator: a0412235; CompType: Label; SymbolVersion: 2012-06-12; ClassName: Label; PartNumber: THT-14-423-10; RoHS: Y; PackageReference: PCB Label 0.650"H x 0.200"W; MountType: N/A; ComponentLink1Description: Web Page; ComponentLink1URL: http://www.bradyid.com/bradyid/pdpv/THT-14-423-10.html; Note: Size: 0.65" x 0.20 "; Publisher: Texas Instruments; LatestRevisionDate: 2012-07-31; LatestRevisionNote: Initial Version; Alternate Manufacturer: -; Alternate PartNumber: -; Supplier 1: Farnell; Supplier Part Number 1: 2065596; Supplier 2: Newark; Supplier Part Number 2: 97C5133
R35 R36 = CRCW06030000Z0EA: 4.7K; Manufacturer: Vishay-Dale; CompType: Resistor; Res_ohm: 0; Value_Code: 0000; Tolerance_%: 5; Value1: 5%; Power_W: 0.1; Value2: 0.1W; VDC_V: 75; TempCo: 200 ppm/C; EIA_Code: E24; U/M: EA; SymbolVersion: 2009-05-29; PartNumber: CRCW06030000Z0EA; PackageReference: 0603; RoHS: Y; MountType: SMT; Technology: Thick Film; Published: 2008-06-26; Publisher: Texas Instruments; LatestRevisionDate: 2013-01-08; ComponentLink1Description: Datasheet link; ComponentLink1URL: http://www.vishay.com/docs/20035/dcrcwe3.pdf; Supplier 1: Digi-Key; Supplier Part Number 1: 541-0.0GCT-ND; Supplier 2: Mouser; Supplier Part Number 2: 71-CRCW0603-0-E3; Supplier 3: Farnell; Supplier Part Number 3: 1469739
R37-R44 = CRCW08050000Z0EA: RES, 0 ohm, 5%, 0.125W, 0805; Manufacturer: Vishay-Dale; CompType: Resistor; Value_Code: 0000; Tolerance_%: 5; Power_W: 0.125; VDC_V: 150; TempCo: 200 ppm/C; EIA_Code: E24; U/M: EA; SymbolVersion: 2009-05-29; PartNumber: CRCW08050000Z0EA; PackageReference: 0805; RoHS: Y; Res_ohm: 0; Value1: 5%; Value2: 0.125W; MountType: SMT; Technology: Thick Film; Published: 2008-06-26; Publisher: Texas Instruments; LatestRevisionDate: 2014-04-18; ComponentLink1Description: Datasheet link; ComponentLink1URL: http://www.vishay.com/docs/20035/dcrcwe3.pdf; Supplier 1: Digi-Key; Supplier Part Number 1: 541-0.0ACT-ND; Supplier 2: Mouser; Supplier Part Number 2: 71-CRCW0805-0-E3; Supplier 3: Farnell; Supplier Part Number 3: 1469846
R46 R50 = CRCW06030000Z0EA: RES, 0 ohm, 5%, 0.1W, 0603; Manufacturer: Vishay-Dale; CompType: Resistor; Value_Code: 0000; Tolerance_%: 5; Power_W: 0.1; VDC_V: 75; TempCo: 200 ppm/C; EIA_Code: E24; U/M: EA; SymbolVersion: 2009-05-29; PartNumber: CRCW06030000Z0EA; PackageReference: 0603; RoHS: Y; Res_ohm: 0; Value1: 5%; Value2: 0.1W; MountType: SMT; Technology: Thick Film; Published: 2008-06-26; Publisher: Texas Instruments; LatestRevisionDate: 2013-01-08; ComponentLink1Description: Datasheet link; ComponentLink1URL: http://www.vishay.com/docs/20035/dcrcwe3.pdf; Supplier 1: Digi-Key; Supplier Part Number 1: 541-0.0GCT-ND; Supplier 2: Mouser; Supplier Part Number 2: 71-CRCW0603-0-E3; Supplier 3: Farnell; Supplier Part Number 3: 1469739
U6 = FDC2114RGHR: Multi-Channel 12/26-Bit Capacitance to Digital Converter (FDC) for Capacitive Sensing, RGH0016A; Manufacturer: Texas Instruments; SymbolCreator: a0411947; CompType: IC; U/M: EA; SymbolVersion: 2014-04-21; PartNumber: FDC2114RGHR; PackageReference: RGH0016A; MountType: SMT; ComponentLink1Description: Datasheet Link; ComponentLink1URL: https://sps06.itg.ti.com/sites/KMS/crossdivteams/altium/docs/ComponentDatasheets/2015-03-12 - FDC2112_FDC2114_SNOSCZ5.pdf; RoHS: Y; Publisher: Texas Instruments; LatestRevisionDate: 2015-03-20; Alternate Manufacturer: Texas Instruments
Y2 = 625L3C040M00000: OSC, 40 MHz, 3.3 V, SMD; Manufacturer: CTS Electrocomponents; SymbolCreator: a0411947; CompType: Oscillator; U/M: EA; TaMin_C: -20; TaMax_C: 70; Frequency Stability: ±50ppm; SymbolVersion: 2013-04-01; PartNumber: 625L3C040M00000; PackageReference: 2.5x1x2.5mm; MountType: SMT; RoHS: Y; ComponentLink1Description: Datasheet Link; ComponentLink1URL: http://www.ctscorp.com/components/Datasheets/008-0329-0.pdf; Publisher: Texas Instruments; LatestRevisionDate: 2015-02-04; Supplier 1: Digi-Key; Supplier Part Number 1: CTX815CT-ND; Supplier 2: Mouser; Supplier Part Number 2: 774-625L3C040M00000

## Sheet TENG.SchDoc
size A4; SheetNumber: 3; SheetTotal: 5
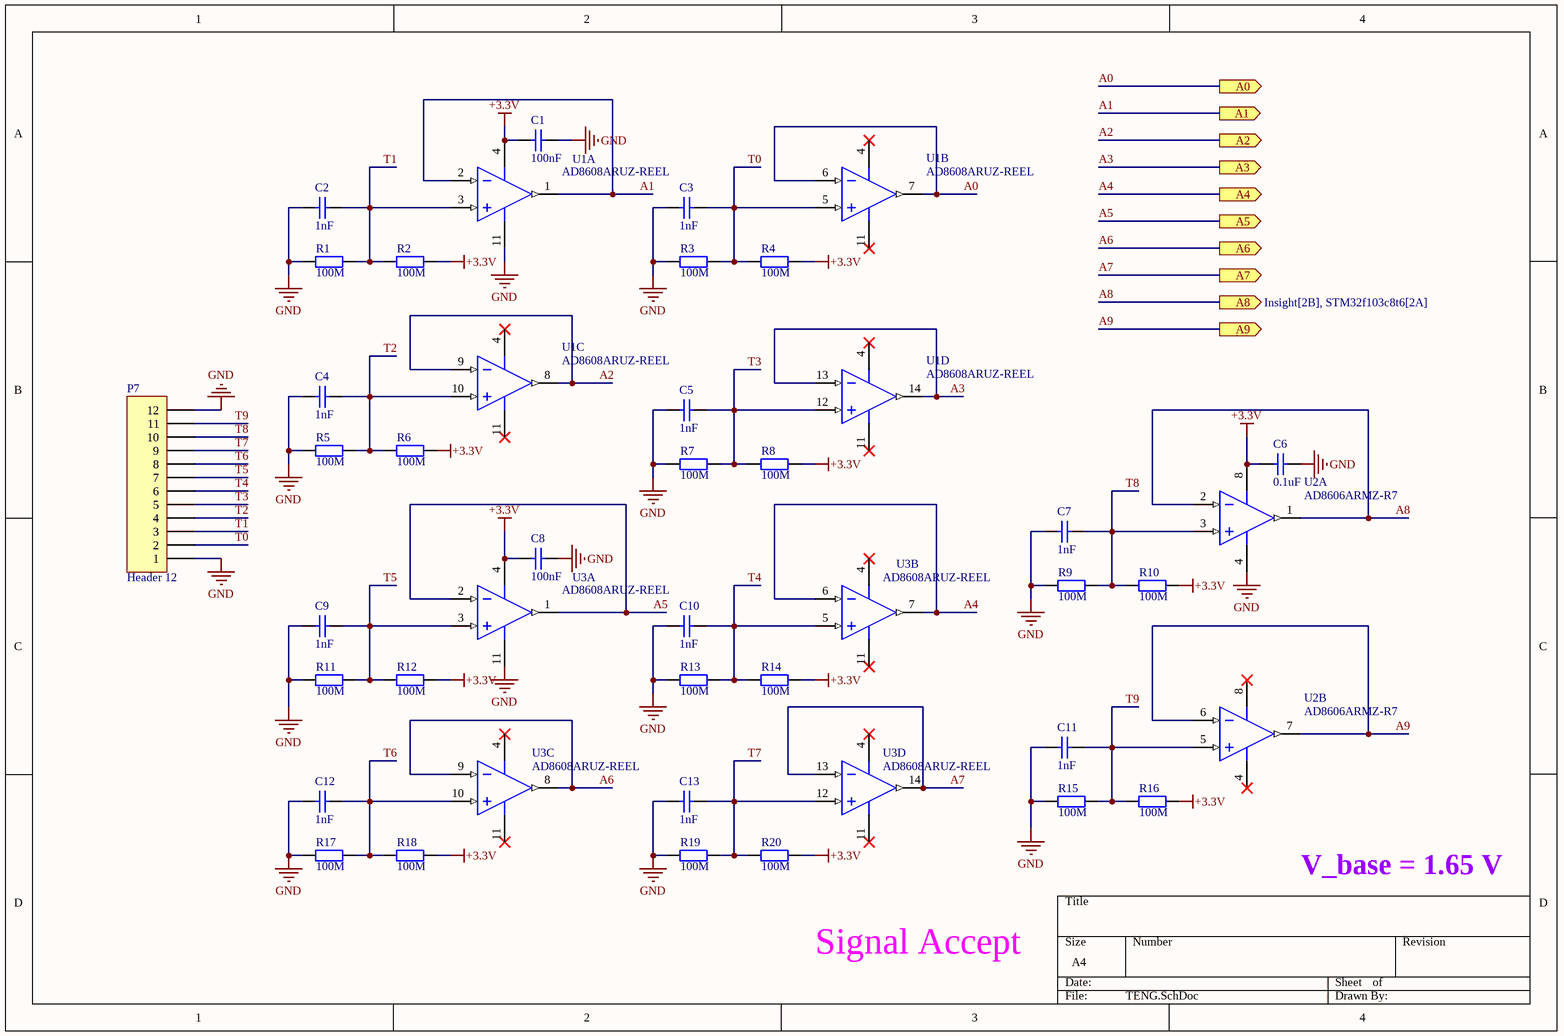
[diagram p3: TENG.SchDoc]

### Parts
C1  100nF  [0402_C]
C2  1nF  [0402_C]
C3  1nF  [0402_C]
C4  1nF  [0402_C]
C5  1nF  [0402_C]
C6  0.1uF  [0402_C]
C7  1nF  [0402_C]
C8  100nF  [0402_C]
C9  1nF  [0402_C]
C10  1nF  [0402_C]
C11  1nF  [0402_C]
C12  1nF  [0402_C]
C13  1nF  [0402_C]
P7  Header 12  [HDR1X12]
R1  100M  [0402_R]
R2  100M  [0402_R]
R3  100M  [0402_R]
R4  100M  [0402_R]
R5  100M  [0402_R]
R6  100M  [0402_R]
R7  100M  [0402_R]
R8  100M  [0402_R]
R9  100M  [0402_R]
R10  100M  [0402_R]
R11  100M  [0402_R]
R12  100M  [0402_R]
R13  100M  [0402_R]
R14  100M  [0402_R]
R15  100M  [0402_R]
R16  100M  [0402_R]
R17  100M  [0402_R]
R18  100M  [0402_R]
R19  100M  [0402_R]
R20  100M  [0402_R]
U1  AD8608ARUZ-REEL  [ADI-RU-14_N]  (parts A,B,C,D of 4)
U2  AD8606ARMZ-R7  [ADI-RM-8_N]  (parts A,B of 2)
U3  AD8608ARUZ-REEL  [ADI-RU-14_N]  (parts A,B,C,D of 4)

### Ports
A0 (out, see Insight[2A], STM32f103c8t6[1A]), A1 (out, see Insight[2B], STM32f103c8t6[1A]), A2 (out, see Insight[2B], STM32f103c8t6[1A]), A3 (out, see Insight[2B], STM32f103c8t6[1A]), A4 (out, see Insight[2B], STM32f103c8t6[1A]), A5 (out, see Insight[2B], STM32f103c8t6[1A]), A6 (out, see Insight[2B], STM32f103c8t6[1A]), A7 (out, see Insight[2B], STM32f103c8t6[1A]), A8 (out, see Insight[2B], STM32f103c8t6[2A]), A9 (out, see Insight[2B], STM32f103c8t6[2A])

### Nets
+3.3V: C1.2 C6.2 C8.2 R2.1 R4.1 R6.1 R8.1 R10.1 R12.1 R14.1 R16.1 R18.1 R20.1 U1.4(+V) U2.8(+V) U3.4(+V)
GND: C1.1 C2.2 C3.2 C4.2 C5.2 C6.1 C7.2 C8.1 C9.2 C10.2 C11.2 C12.2 C13.2 P7.1 P7.12 R1.2 R3.2 R5.2 R7.2 R9.2 R11.2 R13.2 R15.2 R17.2 R19.2 U1.11(-V) U2.4(-V) U3.11(-V)
A0: U1.6(-IN_B) U1.7(OUT_B) ; port A0
A1: U1.1(OUT_A) U1.2(-IN_A) ; port A1
A2: U1.8(OUT_C) U1.9(-IN_C) ; port A2
A3: U1.13(-IN_D) U1.14(OUT_D) ; port A3
A4: U3.6(-IN_B) U3.7(OUT_B) ; port A4
A5: U3.1(OUT_A) U3.2(-IN_A) ; port A5
A6: U3.8(OUT_C) U3.9(-IN_C) ; port A6
A7: U3.13(-IN_D) U3.14(OUT_D) ; port A7
A8: U2.1(OUT_A) U2.2(-IN_A) ; port A8
A9: U2.6(-IN_B) U2.7(OUT_B) ; port A9
T0: C3.1 P7.2 R3.1 R4.2 U1.5(+IN_B)
T1: C2.1 P7.3 R1.1 R2.2 U1.3(+IN_A)
T2: C4.1 P7.4 R5.1 R6.2 U1.10(+IN_C)
T3: C5.1 P7.5 R7.1 R8.2 U1.12(+IN_D)
T4: C10.1 P7.6 R13.1 R14.2 U3.5(+IN_B)
T5: C9.1 P7.7 R11.1 R12.2 U3.3(+IN_A)
T6: C12.1 P7.8 R17.1 R18.2 U3.10(+IN_C)
T7: C13.1 P7.9 R19.1 R20.2 U3.12(+IN_D)
T8: C7.1 P7.10 R9.1 R10.2 U2.3(+IN_A)
T9: C11.1 P7.11 R15.1 R16.2 U2.5(+IN_B)

### Notes on the sheet
- V_base = 1.65 V
- Signal Accept

### Library data of the parts
C1-C13 = Cap_0402: 0402贴片电容; Package: 0402; 常见贴片电容尺寸图: https://wenku.baidu.com/view/21d5206100f69e3143323968011ca300a6c3f6b2.html
P7 = Header 12: Header, 12-Pin; LatestRevisionDate: 17-Jul-2002; LatestRevisionNote: Re-released for DXP Platform.; Publisher: Altium Limited
R1-R20 = Res_0402: 贴片电阻; ComponentLink1Description: 供应商链接; ComponentLink1URL: http://www.szlcsc.com/product/details_17853.html; Package: 0402; Supplier: LC; SuppliersPartNumber: C17168
U1 U3 = AD8608-SMALL: Quad Channel Wide Bandwidth Operational Amplifier, 10 MHz BW, 5 V/us SR, Industrial, 14-pin SOP (RU-14), Reel; Generic Part Number: AD8608; Manufacturer: Analog Devices; Small Signal Bandwidth: 10MHz; V Span Min: 2.7V; Slew Rate: 5V/us; Iq/Amp: 1.2mA; Input Bias Current: 200fA; V Span Max: 6V; Amplifiers Per Package: 4; Input Offset Voltage: 20uV; RevisionNote: Reference Circuit URL fixed; PartNumber: AD8608ARUZ-REEL; ComponentLink4Description: Reference Circuit; DatasheetVersion: Rev. L; ComponentLink2Description: Datasheet; ComponentLink2URL: http://www.analog.com/static/imported-files/data_sheets/AD8605_8606_8608.pdf; ComponentLink1URL: http://www.analog.com/en/index.html; Code_JEDEC: MO-153AB-1; ComponentLink1Description: Manufacturer URL; ComponentLink3URL: http://www.analog.com/static/imported-files/packages/36057385283879153717235186773RU14.pdf; PackageReference: RU-14; ComponentLink4URL: http://www.analog.com/en/all-operational-amplifiers-op-amps/operational-amplifiers-op-amps/ad8608/products/product.html#product-recommendations; ComponentLink3Description: Package Specification; Mounting Technology: Surface Mount; PackageDescription: 14-Pin Thin Shrink Small Outline Package, Body 5 x 4.4 mm, Pitch 0.65 mm
U2 = AD8606: Double Channel Wide Bandwidth Operational Amplifier, 10 MHz BW, 5 V/us SR, Industrial, 8-pin SOP (RM-8), Reel; Manufacturer: Analog Devices; V Span Min: 2.7V; Iq/Amp: 1.2mA; Amplifiers Per Package: 2; Input Bias Current: 200fA; Input Offset Voltage: 20uV; V Span Max: 6V; Small Signal Bandwidth: 10MHz; Slew Rate: 5V/us; ComponentLink1Description: Manufacturer URL; ComponentLink4URL: http://www.analog.com/en/all-operational-amplifiers-op-amps/operational-amplifiers-op-amps/ad8606/products/product.html#product-recommendations; PartNumber: AD8606ARMZ-R7; Generic Part Number: AD8606; ComponentLink4Description: Reference Circuit; ComponentLink2Description: Datasheet; ComponentLink3Description: Package Specification; ComponentLink2URL: http://www.analog.com/static/imported-files/data_sheets/AD8605_8606_8608.pdf; Code_JEDEC: MO-187-AA; ComponentLink1URL: http://www.analog.com/en/index.html; DatasheetVersion: Rev. L; PackageDescription: 8-Pin Mini Small Outline Package, Body 3 x 3 mm, Pitch 0.65 mm; RevisionNote: Reference Circuit URL fixed; Mounting Technology: Surface Mount; PackageReference: RM-8; ComponentLink3URL: http://www.analog.com/static/imported-files/packages/PKG_PDF/MSOP%28RM%29/RM_8.pdf

## Sheet OnOffCircuit.SchDoc
size A4; SheetNumber: 5; SheetTotal: 5
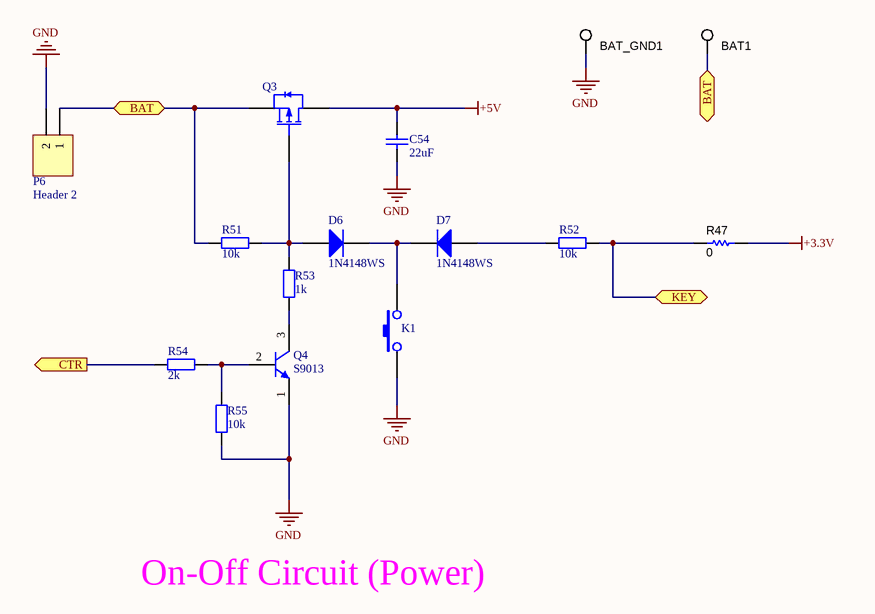
[diagram p4: OnOffCircuit.SchDoc]

### Parts
BAT1  5015  [Testpoint_Keystone_Miniature]  (value not drawn)
BAT_GND1  5015  [Testpoint_Keystone_Miniature]  (value not drawn)
C54  22uF  [0603]
D6  1N4148WS  [SOD-323]
D7  1N4148WS  [SOD-323]
K1  KEY-2  [KEY-6*6*9.5]  (value not drawn)
P6  Header 2  [XH254-2]
Q3  AO3401A P道沟 X13A15 SOT-23  [SOT-23-3L]  (value not drawn)
Q4  S9013  [SOT-23-3_L2.9-W1.3-P1.90-LS2.4-BR]
R47  value 0  [0805_R]  (hidden comment: CRCW06030000Z0EA)
R51  10k  [0805_R]
R52  10k  [0805_R]
R53  1k  [0805_R]
R54  2k  [0805_R]
R55  10k  [0805_R]

### Ports
BAT (bidir, see Insight[2C], STM32f103c8t6[3A]), CTR (out, see Insight[3C], STM32f103c8t6[2D]), KEY (bidir, see Insight[3C], STM32f103c8t6[2D])

### Nets
+3.3V: R47.2
+5V: C54.2 Q3.3(D)
GND: BAT_GND1.1 C54.1 K1.1 P6.2 Q4.1(E) R55.1
B12: R47.1 R52.2 ; port KEY
B13: R54.2 ; port CTR
NetBAT1_1: BAT1.1 P6.1 Q3.2(S) R51.1 ; port BAT
NetD6_1: D6.1(A) Q3.1(G) R51.2 R53.2
NetD6_2: D6.2(K) D7.2(K) K1.2
NetD7_1: D7.1(A) R52.1
NetQ4_2: Q4.2(B) R54.1 R55.2
NetQ4_3: Q4.3(C) R53.1

### Notes on the sheet
- On-Off Circuit (Power)

### Library data of the parts
BAT1 BAT_GND1 = 5015: as GND1 on sheet STM32f103c8t6; SymbolVersion: 2008-07-10; PartNumber: 5015; Value: SMT; PackageReference: Testpoint_Keystone_Miniature; RoHS: Y; MountType: SMT; ComponentLink1Description: Datasheet Link; ComponentLink1URL: http://www.keyelco.com/userAssets/store/files/5015.PDF; Publisher: Texas Instruments; LatestRevisionDate: 2014-09-23; Supplier 1: Digi-Key; Supplier Part Number 1: 5015KCT-ND
C54 = Cap_0402: 0402贴片电容; Package: 0402; 常见贴片电容尺寸图: https://wenku.baidu.com/view/21d5206100f69e3143323968011ca300a6c3f6b2.html
D6 D7 = 1N4148WS_SOD-323: 二极管; ComponentLink1Description: 供应商链接; ComponentLink1URL: http://www.szlcsc.com/product/details_2485.html; Package: SOD-323; Supplier: LC; SuppliersPartNumber: C2128
P6 = Header 2: Header, 2-Pin; LatestRevisionDate: 17-Jul-2002; LatestRevisionNote: Re-released for DXP Platform.; Publisher: Altium Limited
Q3 = AO3401A P道沟 X13A15 SOT-23: MOS(场效应管); ComponentLink1Description: 供应商链接; ComponentLink1URL: http://www.szlcsc.com/product/details_15801.html; Package: SOT-23; Supplier: LC; SuppliersPartNumber: C15127
Q4 = 9013_TO-92: NPN型小功率三极管; 管脚判断: s9014,s9013，s9015，s9012，s9018系列的晶体小功率三极管，把显示文字平面朝自己，从左向右依次为e发射极 b基极 c集电极; HelpURL: https://baike.baidu.com/item/9013%E4%B8%89%E6%9E%81%E7%AE%A1/10925006?fr=aladdin
R47 = CRCW06030000Z0EA: as R46 on sheet FDC2214; SymbolVersion: 2009-05-29; PartNumber: CRCW06030000Z0EA; PackageReference: 0603; RoHS: Y; Res_ohm: 0; Value1: 5%; Value2: 0.1W; MountType: SMT; Technology: Thick Film; Published: 2008-06-26; Publisher: Texas Instruments; LatestRevisionDate: 2013-01-08; ComponentLink1Description: Datasheet link; ComponentLink1URL: http://www.vishay.com/docs/20035/dcrcwe3.pdf; Supplier 1: Digi-Key; Supplier Part Number 1: 541-0.0GCT-ND; Supplier 2: Mouser; Supplier Part Number 2: 71-CRCW0603-0-E3; Supplier 3: Farnell; Supplier Part Number 3: 1469739
R51-R55 = Res_0805: 0805贴片电阻; ComponentLink1Description: 供应商链接; ComponentLink1URL: http://www.szlcsc.com/product/details_26856.html; Package: 0805; Supplier: LC; SuppliersPartNumber: C26113

## Nets that join several sheets
+3.3V: STM32f103c8t6 (24 pins), FDC2214 (J1.13), TENG (16 pins), OnOffCircuit (R47.2)
+5V: STM32f103c8t6 (9 pins), OnOffCircuit (C54.2 Q3.3)
GND: STM32f103c8t6 (39 pins), FDC2214 (J1.11), TENG (28 pins), OnOffCircuit (6 pins)
A0: STM32f103c8t6 (U4.10), TENG (U1.6 U1.7)
A1: STM32f103c8t6 (U4.11), TENG (U1.1 U1.2)
A2: STM32f103c8t6 (U4.12), TENG (U1.8 U1.9)
A3: STM32f103c8t6 (U4.13), TENG (U1.13 U1.14)
A4: STM32f103c8t6 (U4.14), TENG (U3.6 U3.7)
A5: STM32f103c8t6 (U4.15), TENG (U3.1 U3.2)
A6: STM32f103c8t6 (U4.16), TENG (U3.8 U3.9)
A7: STM32f103c8t6 (U4.17), TENG (U3.13 U3.14)
A8: STM32f103c8t6 (U4.18), TENG (U2.1 U2.2)
A9: STM32f103c8t6 (U4.19), TENG (U2.6 U2.7)
B5: STM32f103c8t6 (U4.41), FDC2214 (J1.9)
B6: STM32f103c8t6 (U4.42), FDC2214 (J1.1)
B7: STM32f103c8t6 (U4.43), FDC2214 (J1.3)
B8: STM32f103c8t6 (U4.45), FDC2214 (J1.7)
B9: STM32f103c8t6 (U4.46), FDC2214 (J1.5)
B12: STM32f103c8t6 (U4.25), OnOffCircuit (R47.1 R52.2)
B13: STM32f103c8t6 (U4.26), OnOffCircuit (R54.2)
NetBAT1_1: STM32f103c8t6 (P1.3), OnOffCircuit (BAT1.1 P6.1 Q3.2 R51.1)